# EAGLE design Clock_with_LED (EAGLE 8.2.1)
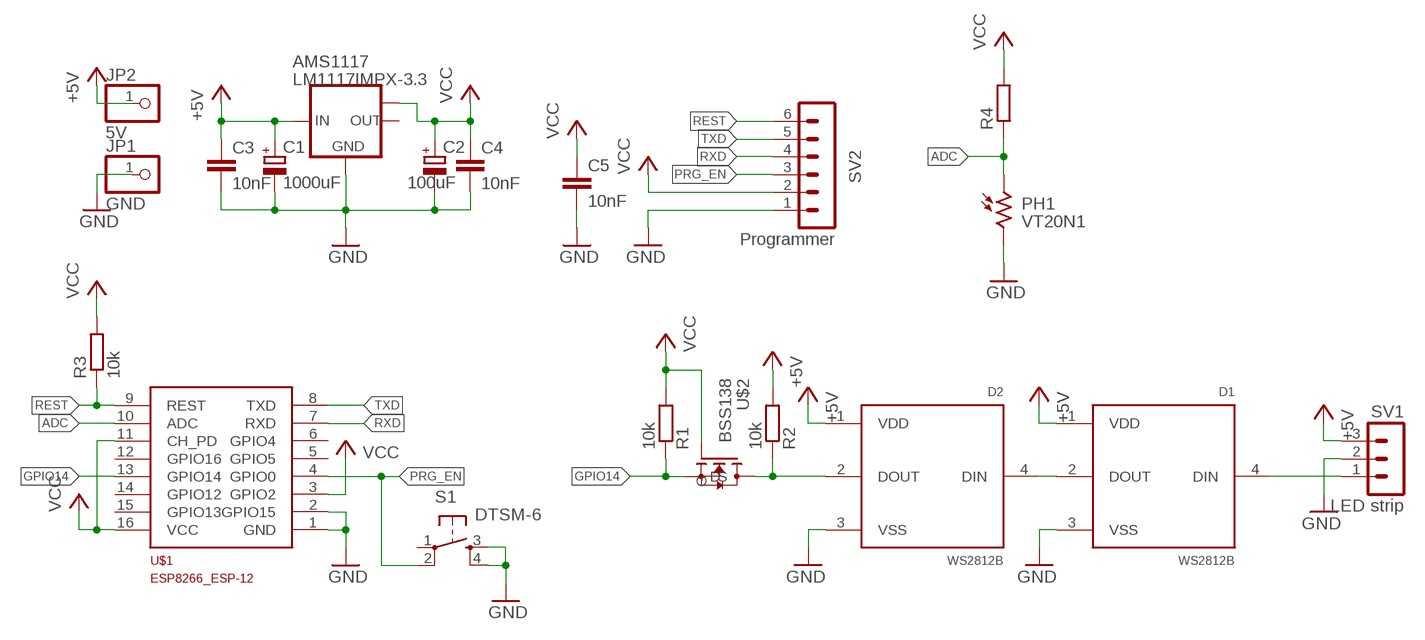
[diagram p0: schematic, sheet 1]

## Parts
AMS1117  LM1117IMPX-3.3  [SOT223]
C1  1000uF  CPOL-EUTT5D11L  [TT5D11L]
C2  100uF  CPOL-EUTT5D7L  [TT5D7L]
C3  10nF  C-EUC0805  [C0805]
C4  10nF  C-EUC0805  [C0805]
C5  10nF  C-EUC0805  [C0805]
D1  WS2812B  [LED_WS2812B]
D2  WS2812B  [LED_WS2812B]
JP1  GND  PINHD-1X1  [1X01]
JP2  5V  PINHD-1X1  [1X01]
PH1  VT20N1  [TO46-VT200]
R1  10k  R-EU_R0805  [R0805]
R2  10k  R-EU_R0805  [R0805]
R3  10k  R-EU_R0805  [R0805]
R4  R-EU_R0805  [R0805]
S1  DTSM-6  [DTSM-6]
SV1  LED strip  MA03-1  [MA03-1]
SV2  Programmer  MA06-1  [MA06-1]
U$1  ESP8266_ESP-12  [ESP8266-ESP12]
U$2  BSS138  [BSS138]

## Nets
+5V: AMS1117.3(IN) C1.+ C3.1 D1.1(VDD) D2.1(VDD) JP2.1 R2.2 SV1.3
ADC: PH1.1 R4.1 U$1.10(ADC)
GND: AMS1117.1(GND) C1.- C2.- C3.2 C4.2 C5.2 D1.3(VSS) D2.3(VSS) JP1.1 PH1.2 S1.3 S1.4 SV1.2 SV2.1 U$1.1(GND) U$1.2(GPIO15)
GPIO14: R1.1 U$1.13(GPIO14) U$2.S
N$1: D1.2(DOUT) D2.4(DIN)
N$2: D1.4(DIN) SV1.1
N$7: D2.2(DOUT) R2.1 U$2.D
PRG_EN: S1.2 SV2.3 U$1.4(GPIO0)
REST: R3.1 SV2.6 U$1.9(REST)
RXD: SV2.4 U$1.7(RXD)
TXD: SV2.5 U$1.8(TXD)
VCC: AMS1117.TAB(OUT1) C2.+ C4.1 C5.1 R1.2 R3.2 R4.2 SV2.2 U$1.3(GPIO2) U$1.11(CH_PD) U$1.16(VCC) U$2.G
Unconnected: AMS1117.2(OUT) S1.1 U$1.5(GPIO5) U$1.6(GPIO4) U$1.12(GPIO16) U$1.14(GPIO12) U$1.15(GPIO13)

## Library data of the parts
AMS1117 = lm1117:LM1117IMPX-*
C1 C2 = rcl:CPOL-EU: POLARIZED CAPACITOR, European symbol
C3-C5 = rcl:C-EU: CAPACITOR, European symbol
D1 D2 = WS2812B:WS2812B: Ws2812b 5050 Rgb Led With Integrated Driver Chip Pack Of 10; AVAILABILITY: Warning; DESCRIPTION: Intelligent Control Led Integrated Light Source Pack Of 10; MF: Adafruit Industries; MP: WS2812B; PACKAGE: None; PRICE: 5.56 USD
JP1 JP2 = pinhead:PINHD-1X1: PIN HEADER
PH1 = photo-elements:VT2*: Photoconductive Cell VT200 Series Source: http://optoelectronics.perkinelmer.com/content/Datasheets/DTS_vt200seriesdatasheet.pdf
R1-R4 = rcl:R-EU_: RESISTOR, European symbol
S1 = switch-tact:DTSM-6
SV1 = con-lstb:MA03-1: PIN HEADER; OC_FARNELL: unknown; OC_NEWARK: unknown
SV2 = con-lstb:MA06-1: PIN HEADER; OC_FARNELL: unknown; OC_NEWARK: unknown
U$1 = ESP8266-ESP12:ESP8266_ESP-12
U$2 = BSS138:BSS138: BSS138 N-Channel Logic Level Enhancement Mode Field Effect Transistor; AVAILABILITY: Good; DESCRIPTION: B138 Series 50 V 6 Ohms N-Ch Logic Level Enhancement Mode FET - SOT-23-3; MF: Fairchild Semiconductor; MP: BSS138; PACKAGE: SOT-23-3 Fairchild Semiconductor; PRICE: 18.54 USD

## Board
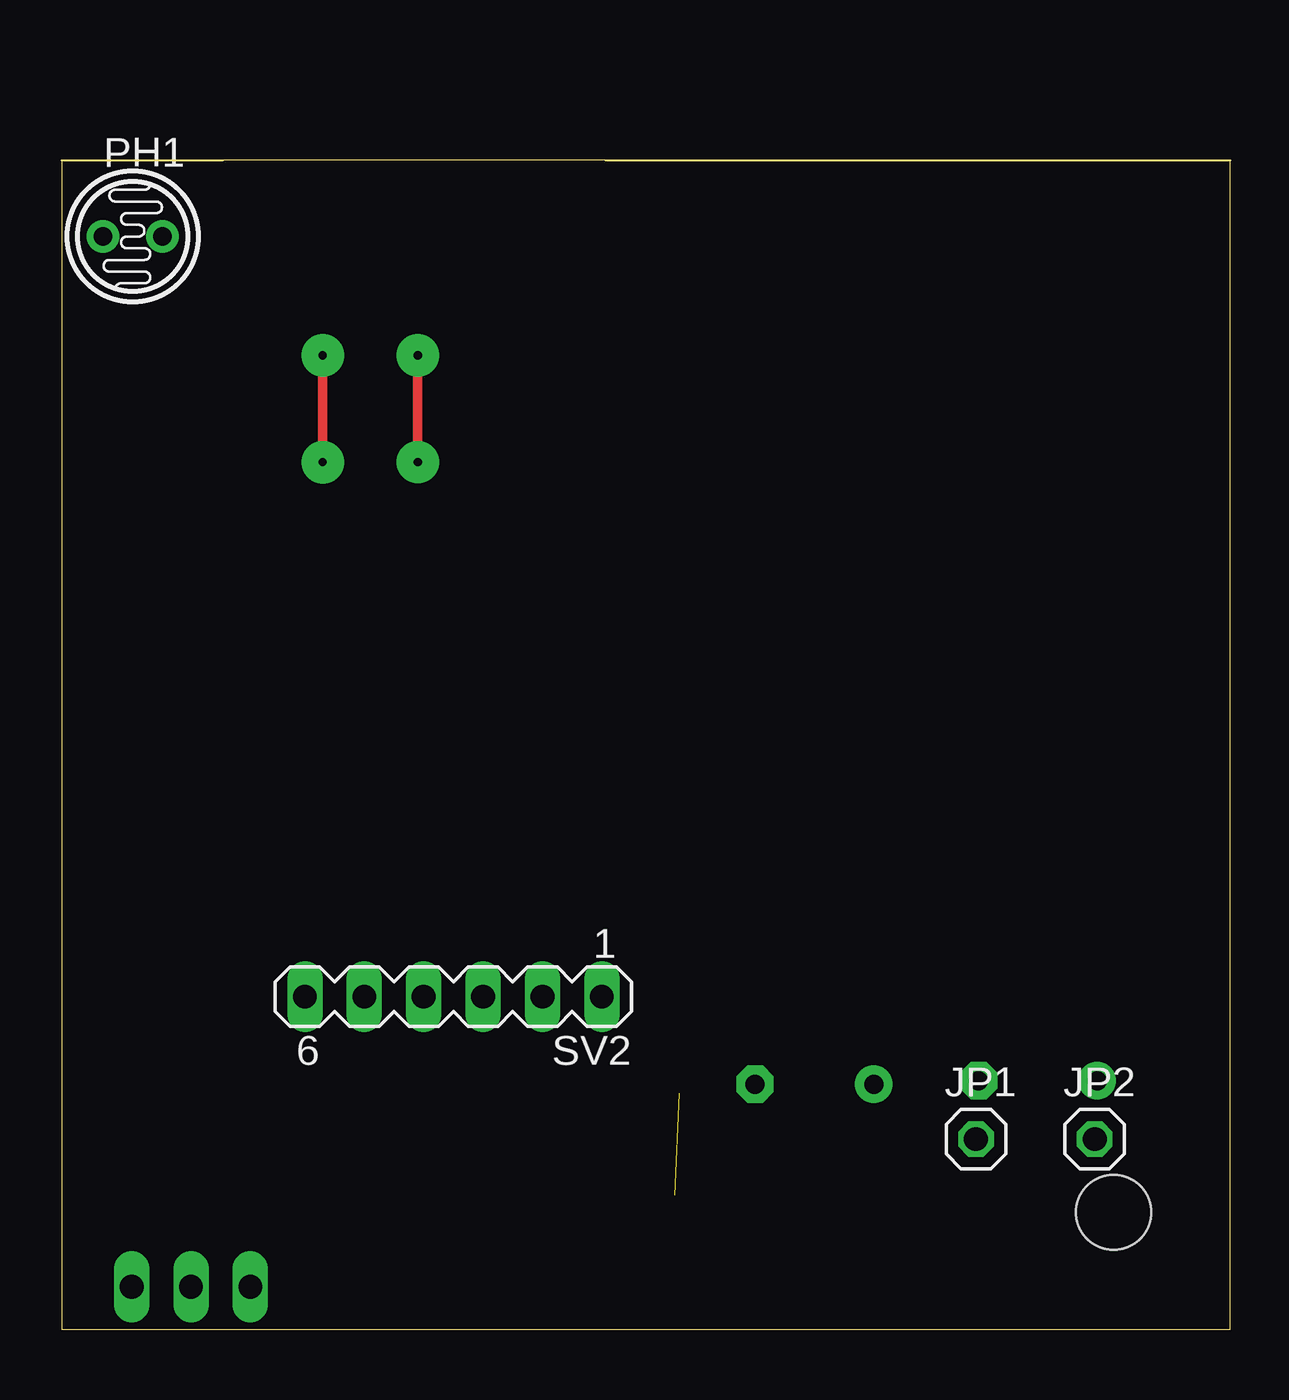
[diagram p1: board, top side]
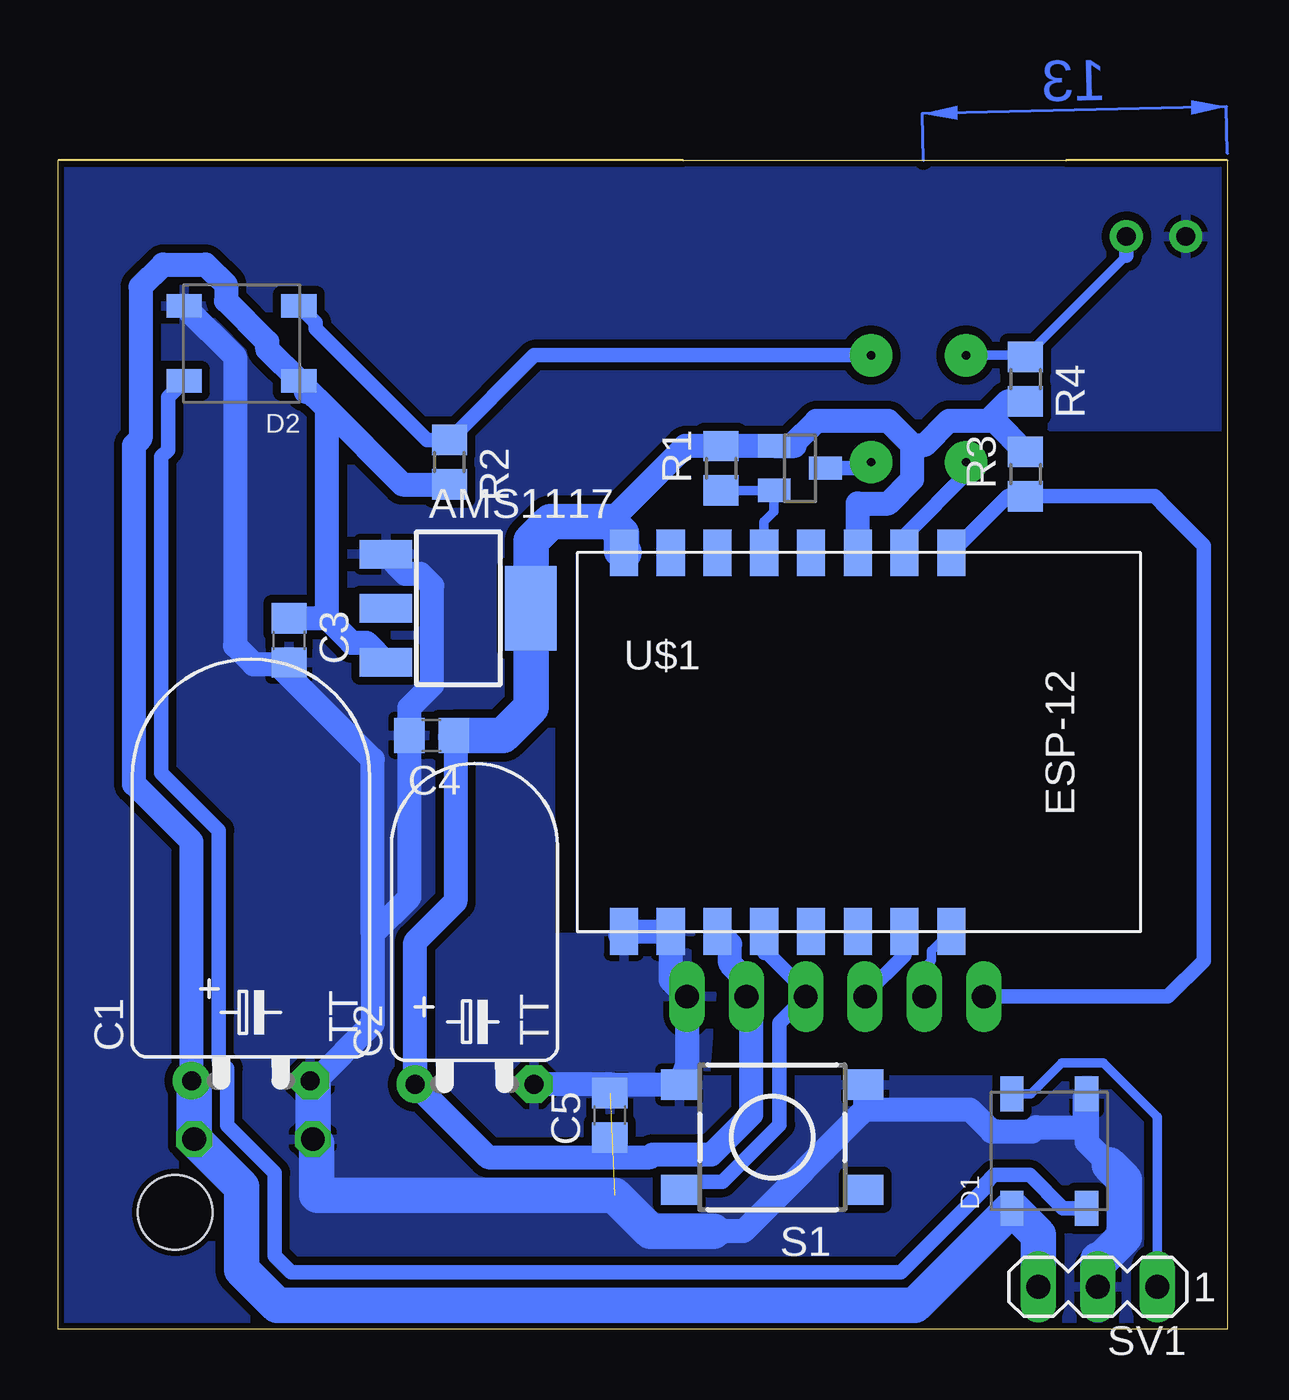
[diagram p2: board, bottom side, seen from below]

Size 50 x 50 mm. Coordinates in mm from the lower left corner, seen from the top.
Outline: 0,0 50,0 50,50 23.28,50 6.9,50 0,50 0,0
Copper layers (1*16): Top 0.035mm / dielectric 1.5mm / Bottom 0.035mm
Design rules "default *": minimum track width 6mil, minimum drill 0.35mm, track to track 14mil, track to pad 14mil, pad to pad 14mil, via to via 14mil, smd to smd 6mil, copper to edge 10mil, drill to drill 10mil, minimum pad ring 10mil, minimum via ring 8mil, stop-mask expansion 4mil, vias tented up to drill 0mil, thermal gap 10mil
Holes 3.2 mm at 45,5

### Footprints (pad centres in the part's own frame; a part is rotated, then mirrored left to right if it is on the bottom)
SOT223 = smd 1.219 x 2.235: 1 -2.311,-3.099; 2 0,-3.099; 3 2.311,-3.099 | smd 3.6 x 2.2: TAB 0,3.099
TT5D11L = drill 0.813 pad 1.6: + -2.54,0 | drill 0.813 pad 1.6 octagon: - 2.54,0
TT5D7L = drill 0.813 pad 1.6: + -2.54,0 | drill 0.813 pad 1.6 octagon: - 2.54,0
C0805 = smd 1.3 x 1.5: 1 -0.95,0; 2 0.95,0
LED_WS2812B = smd 1.5 x 1: 1 -2.45,1.6; 2 -2.45,-1.6; 3 2.45,-1.6; 4 2.45,1.6
1X01 = drill 1.016 octagon: 1 0,0
TO46-VT200 = drill 0.8 pad 1.4: 1 -1.27,0; 2 1.27,0
R0805 = smd 1.3 x 1.5: 1 -0.95,0; 2 0.95,0
DTSM-6 = smd 1.55 x 1.3: 1 -3.975,2.25; 2 3.975,2.25; 3 -3.975,-2.25; 4 3.975,-2.25
MA03-1 = drill 1.016 long: 1 -2.54,0; 2 0,0; 3 2.54,0
MA06-1 = drill 1.016 long: 1 -6.35,0; 2 -3.81,0; 3 -1.27,0; 4 1.27,0; 5 3.81,0; 6 6.35,0
ESP8266-ESP12 = smd 2 x 1.2: 1 16.2,2; 2 16.2,4; 3 16.2,6; 4 16.2,8; 5 16.2,10; 6 16.2,12; 7 16.2,14; 8 16.2,16; 9 0,16; 10 0,14; 11 0,12; 12 0,10; 13 0,8; 14 0,6; 15 0,4; 16 0,2
BSS138 = smd 1 x 1.4: D 0,1.1; G -0.95,-1.1; S 0.95,-1.1

### Placement (x,y rotation side)
AMS1117  32.89,30.84 270 bottom
C1  41.77,10.63 0 bottom
C2  32.2,10.48 0 bottom
C3  40.13,29.46 270 bottom
C4  34.04,25.4 180 bottom
C5  26.42,9.14 90 bottom
D1  7.62,7.62 90 bottom
D2  42.16,42.16 180 bottom
JP1  39.12,8.13 0 top
JP2  44.2,8.13 0 top
PH1  3.05,46.74 180 top
R1  21.65,36.82 90 bottom
R2  33.27,37.08 270 bottom
R3  8.64,36.58 90 bottom
R4  8.64,40.64 270 bottom
S1  19.47,8.21 180 bottom
SV1  5.54,1.81 180 bottom
SV2  16.76,14.22 180 top
U$1  27.81,33.21 270 bottom
U$2  18.29,36.83 270 bottom

### Tracks (layer width: path | path; a pad name or v marks a point on that pad's centre or on a via)
+5V
  Bottom 1.016: 39.42,40.27 D2.1 41.07,41.92 41.07,42.22 42.84,43.99 42.84,44.67 43.7,45.54 45.52,45.54 46.48,44.58 46.48,38.1 46.77,37.81 46.77,23.31 44.31,20.85 C1.+ | 39.42,40.27 39.42,40.09 | 38.52,39.37 39.42,40.27 | 38.52,39.37 35.28,36.13 R2.2 | AMS1117.3 36.83,29.36 37.47,29.36 38.52,30.41 | C3.1 38.52,30.41 | 38.52,30.41 38.52,39.37
  Bottom 1.524: SV1.3 8.08,4.03 D1.1 13.37,1.02 40.64,1.02 42.16,2.54 42.16,6.1 JP2.1 44.2,10.52 C1.+
ADC  (via drill 0.35 pad 1.81)
  Top 0.406: v11.18,37.08 v11.18,41.66
  Bottom 0.406: R4.1 4.32,45.91 | v11.18,41.66 8.7,41.66
  Bottom 0.61: PH1.1 4.32,45.91 | 8.7,41.66 R4.1 | v11.18,37.08 11.18,36.58 13.72,34.04 13.72,33.31 U$1.10
GND  (1 unrouted)
  Bottom 1.016: 25.97,16.85 U$1.1 U$1.2 23.81,14.92 SV2.1 23.11,11.3 S1.4 23.46,10.48 26.42,10.48 | 26.42,10.48 C2.- | 36.56,16.9 34.99,18.47 C4.2 34.99,26.58 34.01,27.56 34.01,31.8 34.52,32.31 35.15,32.31 AMS1117.1 | 36.56,16.9 36.56,24.37 40.13,27.94 | C5.2 26.42,10.48 | 40.13,27.94 C3.2 | D2.3 42.44,41.59 42.44,29.23 41.66,28.45 40.64,28.45 40.13,27.94 | 36.56,16.9 36.56,13.07 39.12,10.52 | 21.98,4.19 20.7,4.19 15.49,9.4 | S1.3 15.49,9.4 | 15.49,9.4 11.02,9.4 10.08,8.46 8.36,8.46 8.18,8.64 6.1,8.64 6.1,9.99 D1.3 6.02,8 5.06,7.04
  Bottom 1.27: 21.98,4.19 21.76,4.19
  Bottom 1.524: 5.54,2.96 SV1.2 5.54,2.82 4.4,3.96 4.4,6.38 5.06,7.04 | C1.- 39.12,10.52 JP1.1 38.95,7.96 38.95,5.76 38.92,5.73 26.22,5.73 24.68,4.19 21.98,4.19
  pour Bottom (isolate 0.254): 0,50.29 0,38.61 22.35,38.61 22.35,33.02 28.96,33.02 28.96,16.76 21.84,16.76 22.35,10.67 0,10.67 0,-1.52 -0.51,-2.03 50.29,-2.03 50.29,47.75 51.31,50.29
  pour Bottom (no thermals): 45.72,10.16 45.72,5.59 49.78,5.59 49.78,9.65 49.28,10.16
GPIO14
  Bottom 0.406: R1.1 U$2.S 19.39,34.97 19.81,34.54 U$1.13
  Bottom 1.016: R1.1
N$1
  Bottom 0.406: 42.88,11.12 43.24,11.48 43.24,21.3 45.7,23.76 45.7,37.37 45.41,37.65 45.41,39.76 D2.4
  Bottom 0.61: D1.2 7.04,5.17 8.46,6.59 9.98,6.59 10.38,6.19 10.38,6.02 13.96,2.44 40.05,2.44 40.74,3.13 40.74,6.68 42.77,8.72 42.77,11.16 43.14,11.53 43.14,21.34 45.6,23.8 45.6,37.33 45.31,37.61 45.31,39.86 D2.4
N$2
  Bottom 0.406: D1.4 8.4,10.07 7.08,11.39 5.3,11.39 3,9.09 SV1.1
N$3
  pour Bottom (no thermals): 7.62,43.18 6.1,49.78 37.59,49.78 38.61,47.75 38.61,44.2 37.59,43.18
N$4  (via drill 0.35)
  other vias: 45,5
N$7  (via drill 0.35 pad 1.81)
  Top 0.406: v15.24,41.66 v15.24,37.08
  Bottom 0.61: U$2.D 15.49,36.83 v15.24,37.08 | 33.09,38.03 R2.1 | 15.38,41.52 v15.24,41.66 29.65,41.66 R2.1 | D2.2 39,43.05 39,42.79 34.24,38.03 R2.1
PRG_EN
  Bottom 0.61: U$1.4 | 23.28,6.12 S1.2 23.1,6.3 21.59,6.3 19.15,8.74 19.15,13.11 SV2.3 18.03,14.46 19.74,16.16 19.74,16.94 U$1.4 | U$1.4 19.81,16.09
REST
  Bottom 0.406: U$1.9 9.56,35.47 | 9.4,35.63 9.56,35.47 | 9.56,35.47 8.8,35.47 R3.1
  Bottom 0.61: 11.94,33.34 U$1.9 | U$1.9 11.81,33.4 | SV2.6 2.54,14.22 1.02,15.75 1.02,33.53 2.54,35.05 3.11,35.63 R3.1 | U$1.9 9.4,35.63
RXD
  Bottom 0.406: SV2.4 15.49,14.31
  Bottom 0.61: U$1.7 13.81,16 15.49,14.31
TXD
  Bottom 0.406: SV2.5 12.95,15.48 12.65,15.78 12.65,16.17 U$1.8
VCC
  Bottom 1.016: 21.84,16.98 U$1.3 21.27,16.48 21.27,15.65 20.57,14.96 SV2.2 20.36,14.01 20.36,9.19 22.07,7.47 24.58,7.47 24.7,7.35 26.42,7.35 | C2.+ 31.62,7.35 26.42,7.35 | 34.74,11.48 C2.+ | C2.+ 34.74,16.56 33.02,18.29 33.02,25.33 C4.1 | 26.42,34.54 23.19,37.77 R1.2 U$2.G 18.52,37.78 18.59,37.85 17.59,38.85 14.51,38.85 13.47,37.82 | 13.47,37.82 13.47,36.35 14.51,35.32 15.81,35.32 U$1.11 | 13.47,37.82 12.95,37.82 11.91,38.85 10.22,38.85 | R4.2 9.38,39.69 10.22,38.85 | 10.22,38.85 9.96,38.85 R3.2 | C5.1 26.42,7.35
  Bottom 1.524: U$1.16 25.91,33.31 25.91,34.04 26.42,34.54 28.96,34.54 29.79,33.71 AMS1117.TAB 29.79,26.59 30.99,25.4 32.95,25.4 33.02,25.33
(copper drawn outside any net)
  shapes: Bottom area x3

### Text on the board
bRestrict: Jakub Jendryka / Jan Sobków 2017 | - | 5V